# Altium schematic sheet sch_epm.SchDoc: Electronique de Pilotage du Moteur
size A4; CheckedBy: Q.V. Nguyen; Author: Q.V. Nguyen, C. Demasson; DrawnBy: Q.V. Nguyen, C. Demasson; Organization: CNES; DocumentNumber: 1; Revision: 0; SheetNumber: 1; SheetTotal: 4
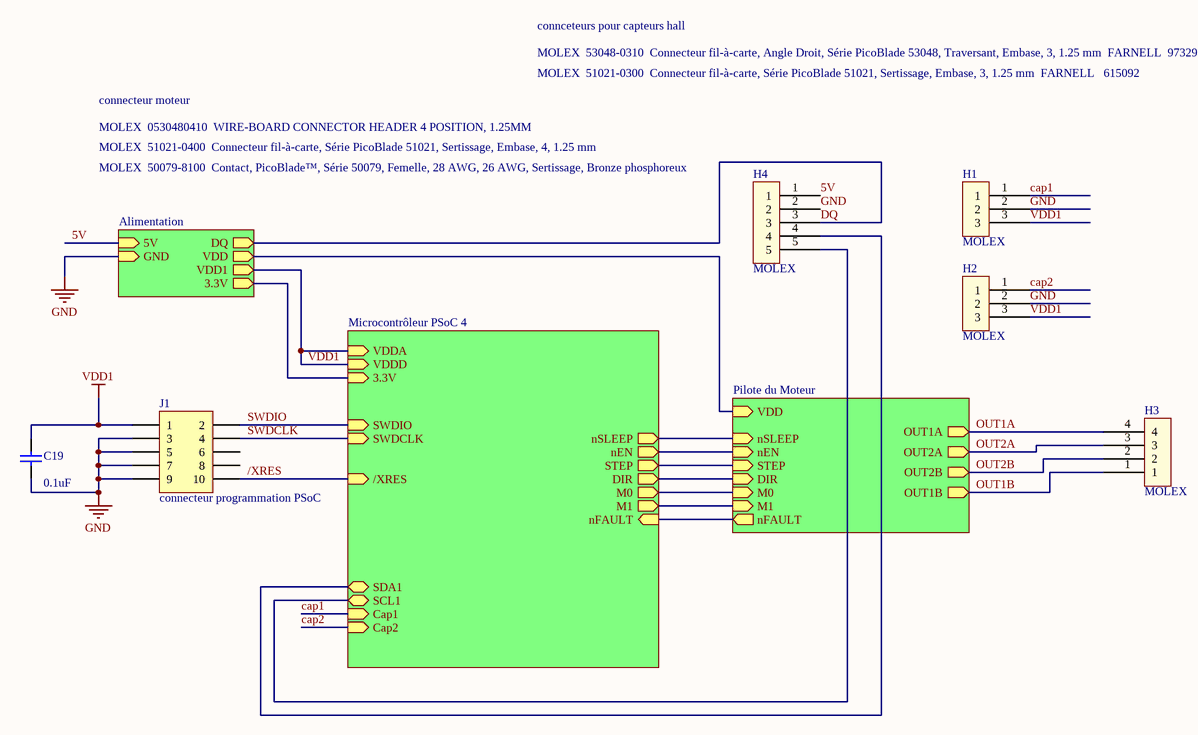
[diagram p0: sch_epm.SchDoc]

## Parts
C19  value 0.1uF  [C1206]
H1  MOLEX  [molex_male_3_broches]
H2  MOLEX  [molex_male_3_broches]
H3  MOLEX  [molex_male_4_broches]
H4  MOLEX  [molex_male_5_broches]
J1  connecteur programmation PSoC  [50MIL_KEYED_SMD]

## Sub-sheets
Alimentation = sch_alim2.0.SchDoc: 5V (in), DQ (out), GND (in), VDD (out), VDD1 (out), 3.3V (out)
Microcontrôleur PSoC 4 = sch_psoc.SchDoc: SWDIO (in), SWDCLK (in), /XRES (in), Cap1 (in), Cap2 (in), M0 (out), DIR (out), STEP (out), nEN (out), nSLEEP (out), nFAULT (in), M1 (out), VDDA (in), VDDD (in), 3.3V (in), SDA1, SCL1
Pilote du Moteur = sch_driver.SchDoc: OUT1A (out), OUT2A (out), OUT2B (out), VDD (in), nSLEEP (in), nEN (in), STEP (in), DIR (in), M0 (in), M1 (in), nFAULT (out), OUT1B (out)

## Nets
GND: C19.1 H1.2 H2.2 H4.2 J1.3 J1.5 J1.7 J1.9 ; sheet Alimentation/GND
VDD1: C19.2 H1.3 H2.3 J1.1 ; sheet Alimentation/VDD1, sheet Microcontrôleur PSoC 4/VDDA, sheet Microcontrôleur PSoC 4/VDDD
5V: H4.1 ; sheet Alimentation/5V
/XRES: J1.10 ; sheet Microcontrôleur PSoC 4//XRES
cap1: H1.1 ; sheet Microcontrôleur PSoC 4/Cap1
cap2: H2.1 ; sheet Microcontrôleur PSoC 4/Cap2
DQ: H4.3 ; sheet Alimentation/DQ
OUT1A: H3.4 ; sheet Pilote du Moteur/OUT1A
OUT1B: H3.1 ; sheet Pilote du Moteur/OUT1B
OUT2A: H3.3 ; sheet Pilote du Moteur/OUT2A
OUT2B: H3.2 ; sheet Pilote du Moteur/OUT2B
SWDCLK: J1.4 ; sheet Microcontrôleur PSoC 4/SWDCLK
SWDIO: J1.2 ; sheet Microcontrôleur PSoC 4/SWDIO
NetH4_4: H4.4 ; sheet Microcontrôleur PSoC 4/SDA1
NetH4_5: H4.5 ; sheet Microcontrôleur PSoC 4/SCL1
(unnamed): sheet Pilote du Moteur/VDD, sheet Alimentation/VDD
(unnamed): sheet Pilote du Moteur/nSLEEP, sheet Microcontrôleur PSoC 4/nSLEEP
(unnamed): sheet Pilote du Moteur/nEN, sheet Microcontrôleur PSoC 4/nEN
(unnamed): sheet Pilote du Moteur/STEP, sheet Microcontrôleur PSoC 4/STEP
(unnamed): sheet Pilote du Moteur/DIR, sheet Microcontrôleur PSoC 4/DIR
(unnamed): sheet Pilote du Moteur/M0, sheet Microcontrôleur PSoC 4/M0
(unnamed): sheet Pilote du Moteur/M1, sheet Microcontrôleur PSoC 4/M1
(unnamed): sheet Pilote du Moteur/nFAULT, sheet Microcontrôleur PSoC 4/nFAULT
(unnamed): sheet Alimentation/3.3V, sheet Microcontrôleur PSoC 4/3.3V

Not connected (* = marked no-connect by the designer): J1 6 8

## Notes on the sheet
- MOLEX  53048-0310  Connecteur fil-à-carte, Angle Droit, Série PicoBlade 53048, Traversant, Embase, 3, 1.25 mm  FARNELL  9732918
- MOLEX  51021-0300  Connecteur fil-à-carte, Série PicoBlade 51021, Sertissage, Embase, 3, 1.25 mm  FARNELL   615092
- connceteurs pour capteurs hall
- MOLEX  0530480410  WIRE-BOARD CONNECTOR HEADER 4 POSITION, 1.25MM
- connecteur moteur
- MOLEX  51021-0400  Connecteur fil-à-carte, Série PicoBlade 51021, Sertissage, Embase, 4, 1.25 mm
- (near H4) MOLEX  50079-8100  Contact, PicoBlade™, Série 50079, Femelle, 28 AWG, 26 AWG, Sertissage, Bronze phosphoreux
- Title
- Size:
- Date:
- A4
- Number:
- Revision:
- Sheet
- of
- Drawn by:
- Approved by:

## Library data of the parts
C19 = Cap Semi: Capacitor (Semiconductor SIM Model); Published: 8-Jun-2000; LatestRevisionDate: 29-May-2009; LatestRevisionNote: IPC-7351 Footprint Added.; PackageReference: C1206; Publisher: Altium Limited; PackageDescription: Chip Capacitor
H1 H2 = Molex Male 3 broches: MOLEX-53048-0510_FARNELL_9732918
H3 = Molex Male 4 broches_1: MOLEX-53048-0510_FARNELL_2064326
H4 = Molex Male 5 broches: MOLEX-53048-0510_FARNELL_2064326
J1 = Header 5X2: Header, 5-Pin, Dual row; LatestRevisionDate: 17-Jul-2002; LatestRevisionNote: Re-released for DXP Platform.; Publisher: Altium Limited